# Altium schematic sheet TEMP_CTRL.SchDoc
size 420 x 297 mm; SheetNumber: 13; SheetTotal: 17
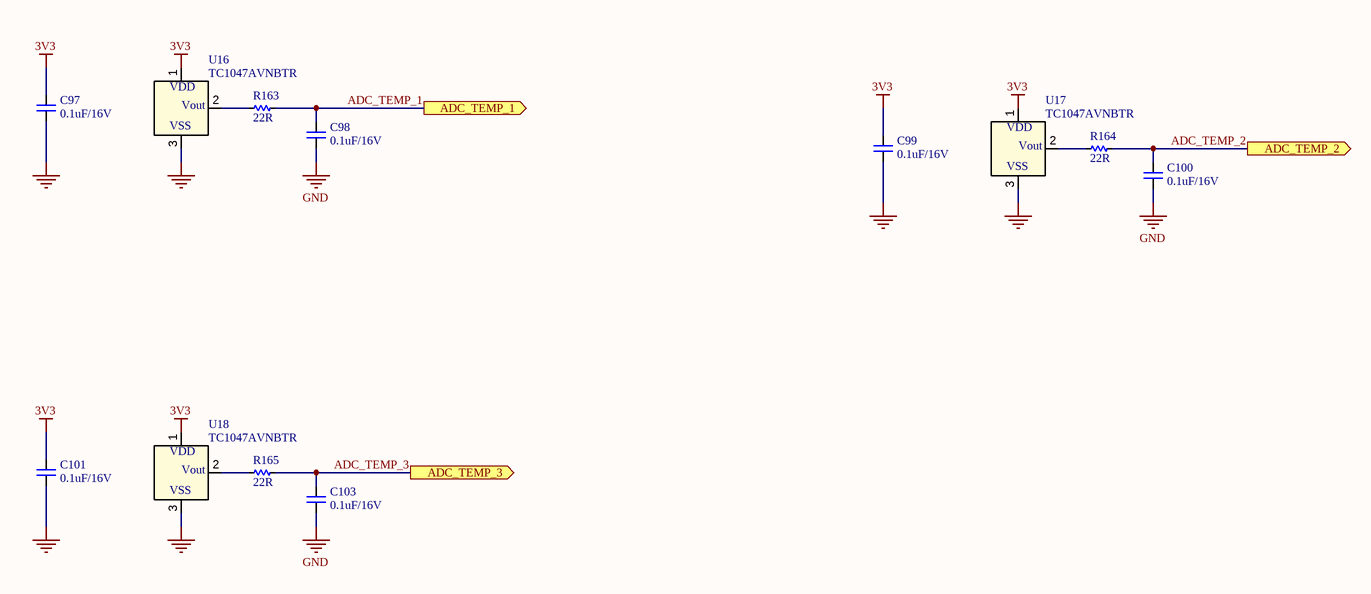
[diagram p0: TEMP_CTRL.SchDoc]

## Parts
C97  0.1uF/16V  [CAP_C_1608X80]
C98  0.1uF/16V  [CAP_C_1608X80]
C99  0.1uF/16V  [CAP_C_1608X80]
C100  0.1uF/16V  [CAP_C_1608X80]
C101  0.1uF/16V  [CAP_C_1608X80]
C103  0.1uF/16V  [CAP_C_1608X80]
R163  22R  [RES_C_1608X60]
R164  22R  [RES_C_1608X60]
R165  22R  [RES_C_1608X60]
U16  TC1047AVNBTR  [SOT-23_MC_MCH]
U17  TC1047AVNBTR  [SOT-23_MC_MCH]
U18  TC1047AVNBTR  [SOT-23_MC_MCH]

## Ports
ADC_TEMP_1 (out), ADC_TEMP_2 (out), ADC_TEMP_3 (out)

## Nets
3V3: C97.2 C99.2 C101.2 U16.1(VDD) U17.1(VDD) U18.1(VDD)
GND: C97.1 C98.1 C99.1 C100.1 C101.1 C103.1 U16.3(VSS) U17.3(VSS) U18.3(VSS)
ADC_TEMP_1: C98.2 R163.2 ; port ADC_TEMP_1
ADC_TEMP_2: C100.2 R164.2 ; port ADC_TEMP_2
ADC_TEMP_3: C103.2 R165.2 ; port ADC_TEMP_3
NetR163_1: R163.1 U16.2(VOUT)
NetR164_1: R164.1 U17.2(VOUT)
NetR165_1: R165.1 U18.2(VOUT)

## Notes on the sheet
- Project:
- BEE-PC1
- Sub-system:
- NANORACK_EXP_CONTROLLER
- Design by:
- SANG HUYNH
- BAO BUI Q.
- Sheet title:
- Sheet
- A3
- of
- Checked by:
- Approved by:
- VU PHAM
- Revision:
- Document No:
- V1.2.2
- Size:
- Date:
- (in symbol TC1047AVNBTR) Vout

## Library data of the parts
C97-C101 C103 = CAP_SMD: CAP_Chip; Value: 33pF
R163-R165 = _RES_B_2: RES
U16-U18 = TC1047AVNBTR: No Description Available; Manufacturer_Name: Microchip; Copyright: Copyright (C) 2025 Ultra Librarian. All rights reserved.; Manufacturer_Part_Number: TC1047AVNBTR; RefDes: RefDes; Type: Type